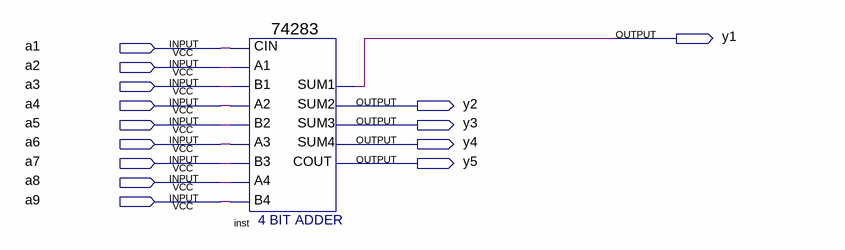
[diagram p0: schematic sheet]
// Quartus schematic 74283a.bdf as structural Verilog: 1 symbols, 14 pins
module \74283a  (
  input  a1,
  input  a2,
  input  a3,
  input  a4,
  input  a5,
  input  a6,
  input  a7,
  input  a8,
  input  a9,
  output y1,
  output y2,
  output y3,
  output y4,
  output y5
);

  \74283  inst (
    .CIN(a1), .A1(a2), .A2(a4), .B2(a5), .A3(a6), .A4(a8), .B4(a9), .B1(a3), .B3(a7), .SUM4(y4), .COUT(y5),
    .SUM1(y1), .SUM2(y2), .SUM3(y3));
endmodule
